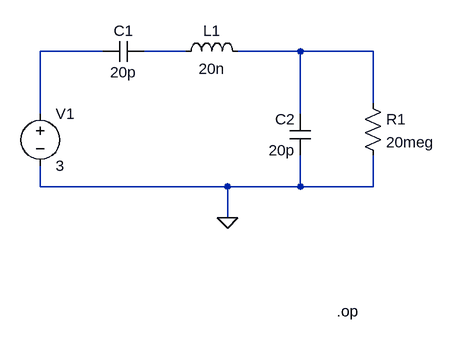
[diagram p0: schematic Draft10.asc]
Draft10.asc, the LTspice schematic file:
Version 4
SHEET 1 880 680
WIRE 112 192 16 192
WIRE 240 192 176 192
WIRE 416 192 320 192
WIRE 528 192 416 192
WIRE 528 272 528 192
WIRE 16 288 16 192
WIRE 416 288 416 192
WIRE 16 400 16 368
WIRE 304 400 16 400
WIRE 416 400 416 352
WIRE 416 400 304 400
WIRE 528 400 528 352
WIRE 528 400 416 400
WIRE 304 448 304 400
FLAG 304 448 0
SYMBOL voltage 16 272 R0
SYMATTR InstName V1
SYMATTR Value 3
SYMBOL cap 176 176 R90
WINDOW 0 0 32 VBottom 2
WINDOW 3 32 32 VTop 2
SYMATTR InstName C1
SYMATTR Value 20p
SYMBOL cap 432 352 R180
WINDOW 0 24 56 Left 2
WINDOW 3 24 8 Left 2
SYMATTR InstName C2
SYMATTR Value 20p
SYMBOL res 512 256 R0
SYMATTR InstName R1
SYMATTR Value 20meg
SYMBOL ind 224 208 R270
WINDOW 0 32 56 VTop 2
WINDOW 3 5 56 VBottom 2
SYMATTR InstName L1
SYMATTR Value 20n
TEXT 472 592 Left 2 !.op

The netlist it stands for:
* Draft10.asc
V1 N001 0 3
C1 N002 N001 20p
C2 0 N003 20p
R1 N003 0 20meg
L1 N002 N003 20n
.op
.backanno
.end